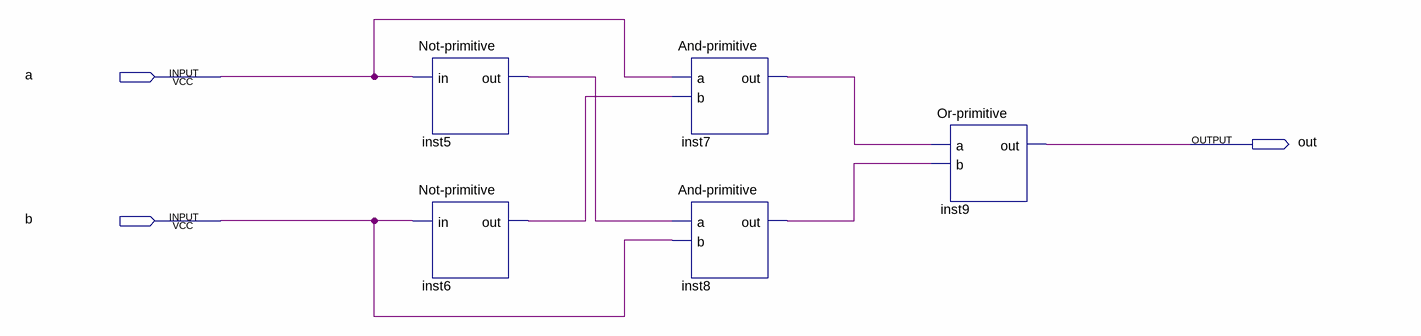
[diagram p0: schematic sheet]
// Quartus schematic Xor-primitive.bdf as structural Verilog: 5 symbols, 3 pins
module \Xor-primitive  (
  input  a,
  input  b,
  output out
);

  wire inst5_out, inst6_out, inst7_out, inst8_out;

  \Not-primitive  inst5 (.in(a), .out(inst5_out));
  \Not-primitive  inst6 (.in(b), .out(inst6_out));
  \And-primitive  inst7 (.a(a), .b(inst6_out), .out(inst7_out));
  \And-primitive  inst8 (.a(inst5_out), .b(b), .out(inst8_out));
  \Or-primitive  inst9 (.a(inst7_out), .b(inst8_out), .out(out));
endmodule
